# Altium project mbed-interface.PrjPcb
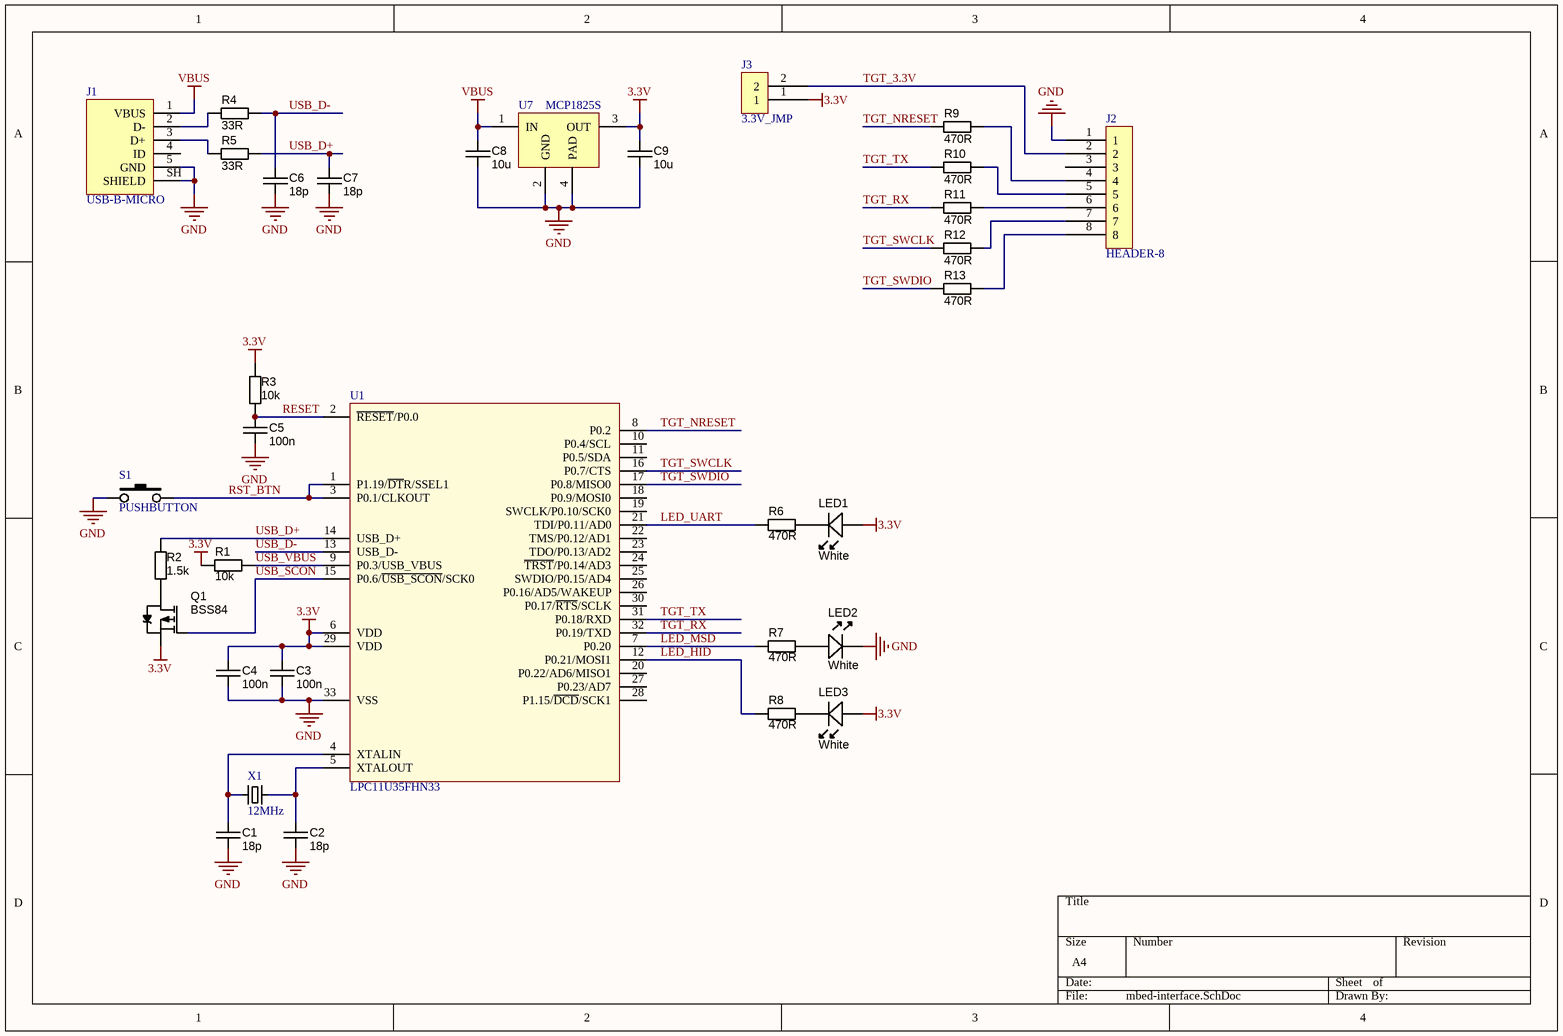
[diagram p0: mbed-interface.SchDoc]
1 sheet, 33 parts. Net scope: global (net labels, ports and power ports of the same name join across sheets).
Board file: mbed-interface.PcbDoc

## Sheet mbed-interface.SchDoc
size A4

### Parts
C1  18p  [CAPC1608X90N]
C2  18p  [CAPC1608X90N]
C3  100n  [CAPC1608X90N]
C4  100n  [CAPC1608X90N]
C5  100n  [CAPC1608X90N]
C6  18p  [CAPC1608X90N]
C7  18p  [CAPC1608X90N]
C8  10u  [CAPC3216X180N]
C9  10u  [CAPC3216X180N]
J1  USB-B-MICRO  [USB-B-MICRO-FCI-10104110]
J2  HEADER-8  [MICRO-MATCH-8]
J3  3.3V_JMP  [PIN-HEADER-2]
LED1  White  [LED-0603-WHITE]
LED2  White  [LED-0603-WHITE]
LED3  White  [LED-0603-WHITE]
Q1  BSS84  [SOT23-3]
R1  10k  [RESC1608X55N]
R2  1.5k  [RESC1608X55N]
R3  10k  [RESC1608X55N]
R4  33R  [RESC1608X55N]
R5  33R  [RESC1608X55N]
R6  470R  [RESC1608X55N]
R7  470R  [RESC1608X55N]
R8  470R  [RESC1608X55N]
R9  470R  [RESC1608X55N]
R10  470R  [RESC1608X55N]
R11  470R  [RESC1608X55N]
R12  470R  [RESC1608X55N]
R13  470R  [RESC1608X55N]
S1  PUSHBUTTON  [KMR421NGLFS]
U1  LPC11U35FHN33  [HVQFN33]
U7  MCP1825S  [SOT230P700X180-4N]
X1  12MHz  [XTAL-3.2x2.5]

### Nets
3.3V: C3.1 C4.1 C9.1 J3.1 LED1.A LED3.A Q1.2(S) R1.2 R3.1 U1.6(VDD) U1.29(VDD) U7.3(OUT)
GND: C1.2 C2.2 C3.2 C4.2 C5.2 C6.2 C7.2 C8.2 C9.2 J1.5(GND) J1.SH(SHIELD) J2.1 LED2.K S1.1 U1.33(VSS) U7.2(GND) U7.4(PAD)
VBUS: C8.1 J1.1(VBUS) U7.1(IN)
LED_HID: R8.1 U1.12(P0.21/MOSI1)
LED_MSD: R7.1 U1.7(P0.20)
LED_UART: R6.1 U1.21(TDI/P0.11/AD0)
RESET: C5.1 R3.2 U1.2(~{RE}~{SET}/P0.0)
RST_BTN: S1.2 U1.1(P1.19/~{DT}R/SSEL1) U1.3(P0.1/CLKOUT)
TGT_3.3V: J2.2 J3.2
TGT_NRESET: R9.1 U1.8(P0.2)
TGT_RX: R11.1 U1.32(P0.19/TXD)
TGT_SWCLK: R12.1 U1.16(P0.7/CTS)
TGT_SWDIO: R13.1 U1.17(P0.8/MISO0)
TGT_TX: R10.1 U1.31(P0.18/RXD)
USB_D+: C7.1 R2.1 R5.2 U1.14(USB_D+)
USB_D-: C6.1 R4.2 U1.13(USB_D-)
USB_SCON: Q1.1(G) U1.15(P0.6/~{USB_SCON}/SCK0)
USB_VBUS: R1.1 U1.9(P0.3/USB_VBUS)
NetC1_1: C1.1 U1.4(XTALIN) X1.1
NetC2_1: C2.1 U1.5(XTALOUT) X1.3
NetJ1_2: J1.2(D-) R4.1
NetJ1_3: J1.3(D+) R5.1
NetJ2_4: J2.4 R9.2
NetJ2_5: J2.5 R10.2
NetJ2_6: J2.6 R11.2
NetJ2_7: J2.7 R12.2
NetJ2_8: J2.8 R13.2
NetLED1_K: LED1.K R6.2
NetLED2_A: LED2.A R7.2
NetLED3_K: LED3.K R8.2
NetQ1_3: Q1.3(D) R2.2

Not connected (* = marked no-connect by the designer): J1 4(ID); J2 3; U1 10(P0.4/SCL) 11(P0.5/SDA) 18(P0.9/MOSI0) 19(SWCLK/P0.10/SCK0) 20(P0.22/AD6/MISO1) 22(TMS/P0.12/AD1) 23(TDO/P0.13/AD2) 24(~{TRST}/P0.14/AD3) 25(SWDIO/P0.15/AD4) 26(P0.16/AD5/WAKEUP) 27(P0.23/AD7) 28(P1.15/~{DCD}/SCK1) 30(P0.17/~{RTS}/SCLK)

### Library data of the parts
C1-C7 = CAPC_8p_0603_NP0_50V: Capacitor SMD Cer 8pF ±0.5pF 50V NP0 0603; Manufacturer 1: Murata Electronics North America; Manufacturer Part Number 1: GRM1885C1H8R0DZ01D; Ratings: 50V; NP0; SCDType: undef; Value: 8p; Tolerance: ±0.5pF; Operating Temperature: -55°C ~ 125°C; Package / Case: 0603 (1608 Metric); Size / Dimension: 0.063" L x 0.032" W (1.60mm x 0.81mm); Thickness (Max): 0.035" (0.90mm); Supplier 1: Digi-Key; Supplier Part Number 1: 490-1399-1-ND; ComponentLink1URL: http://search.murata.co.jp/Ceramy/image/img/PDF/ENG/GRM1885C1H8R0DZ01.pdf; ComponentLink1Description: GRM1885C1H8R0DZ01 datasheet.pdf
C8 C9 = CAPC_10u_1206_10V: Capacitor SMD Cer 10uF 10% 10V X5R 1206; Manufacturer 1: KEMET; Manufacturer Part Number 1: C1206C106K8PACTU; Ratings: 10V; X5R; Material: ceramic; Value: 10µ; SCDType: undef; Package / Case: 1206 (3216 metric); Tolerance: ±10%; Supplier 1: Digi-Key; Supplier Part Number 1: C1206C106K8PACTU-ND
J3 = HEADER-2
LED1-LED3 = LED_SMD_White_0603_Bright: LED 0603 SMD Bright White 8700K; Manufacturer 1: Lite-On Inc; Manufacturer Part Number 1: LTW-C193TS5; Material: InGaN; Ratings: Ultra Bright; 8700K; Millicandela Rating: 230mcd; Voltage - Forward (Vf) Typ: 3.3V; Viewing Angle: 120°; Lens Type: Clear, Tinted; Lens Style/Size: Rectangle with Flat Top, 0.8mm x 1.1mm; Voltage - Forward (Vf) @ 10mA: 3.0V; SCDType: source; Package / Case: 0603 (1608 metric); Supplier 1: Digi-Key; Supplier Part Number 1: 160-1721-1-ND; Supplier 2: Digi-Key; Supplier Part Number 2: APT1608QWF/D-ND; Manufacturer 2: Kingbright Corp; Manufacturer Part Number 2: APT1608QWF/D; Color: White; Size / Dimension: 1.60mm L x 0.80mm W; Mounting Type: Surface Mount; Luminous Flux @ Current - Test: -; ComponentLink2URL: http://www.kingbrightusa.com/images/catalog/SPEC/APT1608QWF-D.pdf; ComponentLink2Description: http://www.kingbrightusa.com/images/catalog/SPEC/APT1608QWF-D.pdf; ComponentLink1URL: http://media.digikey.com/pdf/Data%20Sheets/Lite-On%20PDFs/LTW-C193TS5.pdf; ComponentLink1Description: http://media.digikey.com/pdf/Data%20Sheets/Lite-On%20PDFs/LTW-C193TS5.pdf
Q1 = MOSFET_BSS84: MOSFET SMD P-CH 50V 130mA SOT23-3; Manufacturer 1: Fairchild Semiconductor; Ratings: 50V; 130mA; Material: Metal Oxide; FET Type: MOSFET P-Channel, Metal Oxide; FET Feature: Logic Level Gate; Rds On (Max) @ Id, Vgs: 10 Ohm @ 100mA, 5V; Vgs(th) (Max) @ Id: 2V @ 1mA; Gate Charge (Qg) @ Vgs: 1.3nC @ 5V; Input Capacitance (Ciss) @ Vds: 73pF @ 25V; Power - Max: 360mW; SCDType: undef; Package / Case: SOT23-3; Supplier 1: Digi-Key; Supplier Part Number 1: BSS84CT-ND; Manufacturer Part Number 1: BSS84; Drain to Source Voltage (Vdss): 50V; Current - Continuous Drain (Id) @ 25° C: 130mA; Supplier Device Package: SOT-23; ComponentLink1URL: http://www.fairchildsemi.com/ds/BS/BSS84.pdf; ComponentLink1Description: http://www.fairchildsemi.com/ds/BS/BSS84.pdf
R1-R13 = RES_1K_0603_1%: Resistor SMD chip 1k Ohm 0.1W 1% 0603; Manufacturer 1: Yageo; Manufacturer Part Number 1: RC0603FR-071KL; Ratings: 1/10W; SCDType: spec; Package / Case: 0603 (1608 Metric); Supplier 1: Digi-Key; Supplier Part Number 1: 311-1.00KHRCT-ND; Tolerance: ±1%; Value: 1K
U7 = MIC5239
X1 = XTAL-3.2X2.5